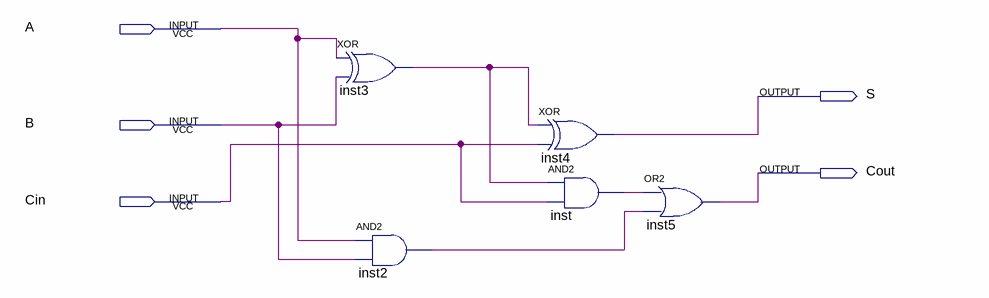
[diagram p0: schematic sheet]
// Quartus schematic SOMADOR2BITS.bdf as structural Verilog: 5 symbols, 5 pins
module SOMADOR2BITS (
  input  A,
  input  B,
  input  Cin,
  output S,
  output Cout
);

  wire inst2_out, inst3_out, inst_out;

  xor inst3 (inst3_out, A, B);
  and inst2 (inst2_out, A, B);
  xor inst4 (S, inst3_out, Cin);
  and inst (inst_out, inst3_out, Cin);
  or inst5 (Cout, inst_out, inst2_out);
endmodule
